# Altium schematic sheet Сборочный А3.SchDoc
size 420 x 297 mm; Address1: Address1; Address2: Address2; Address3: Address3; Address4: Address4; SheetNumber: 1; Scale: 1:1; Разраб.: Павловская В.А.; Пров.: Смолин В.А.; Номер листа: 1; Общее количество листов: 5; Масштаб: 1:1
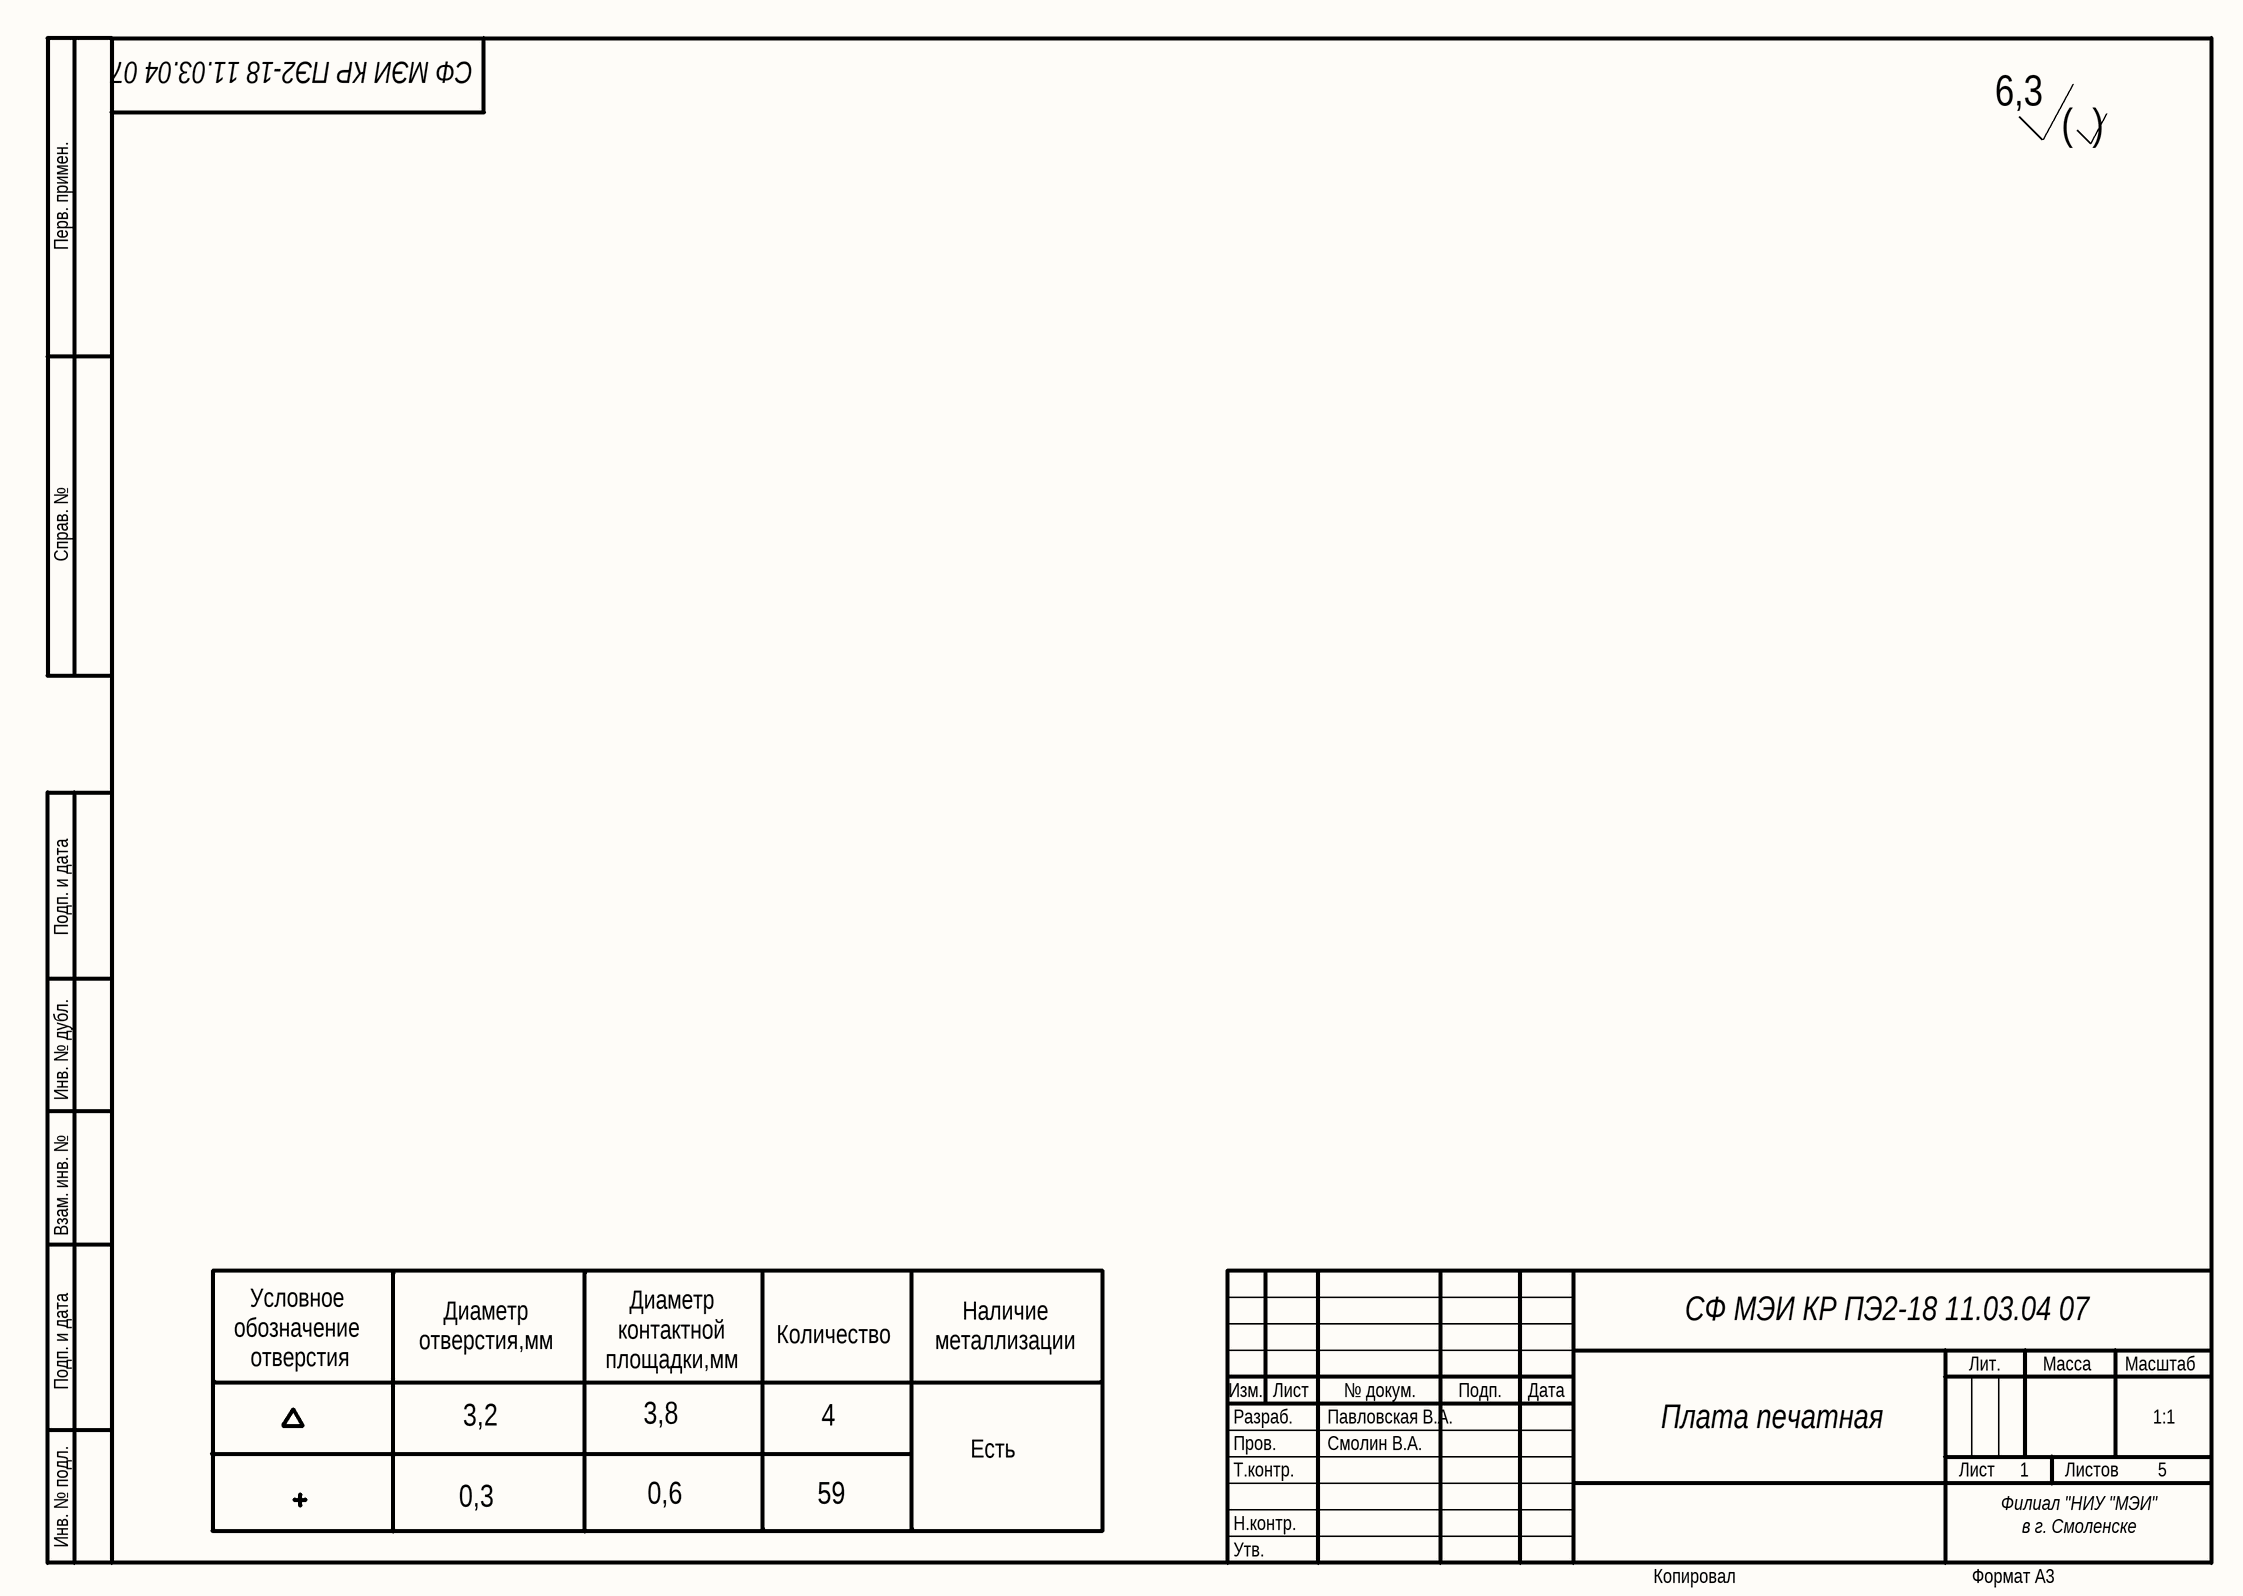
[diagram p0: Сборочный А3.SchDoc]

## Notes on the sheet
- СФ МЭИ КР ПЭ2-18 11.03.04 07
- 6,3
- (  )
- Перв. примен.
- Справ. №
- Подп. и дата
- Инв. № дубл.
- Взам. инв. №
- Условное
  обозначение
  отверстия
- Диаметр
  отверстия,мм
- Диаметр
  контактной
  площадки,мм
- Количество
- Наличие
  металлизации
- Разраб.
- Изм.
- Лист
- № докум.
- Подп.
- Дата
- Плата печатная
- Лит.
- Масса
- Масштаб
- 3,2
- 3,8
- 4
- Есть
- Пров.
- Т.контр.
- Листов
- Инв. № подл.
- 0,3
- 0,6
- 59
- Утв.
- Н.контр.
- Филиал "НИУ "МЭИ"
  в г. Смоленске
  ПЭ2-18
- Копировал
- Формат А3